# Altium schematic sheet 12.SchDoc
size 297 x 209 mm
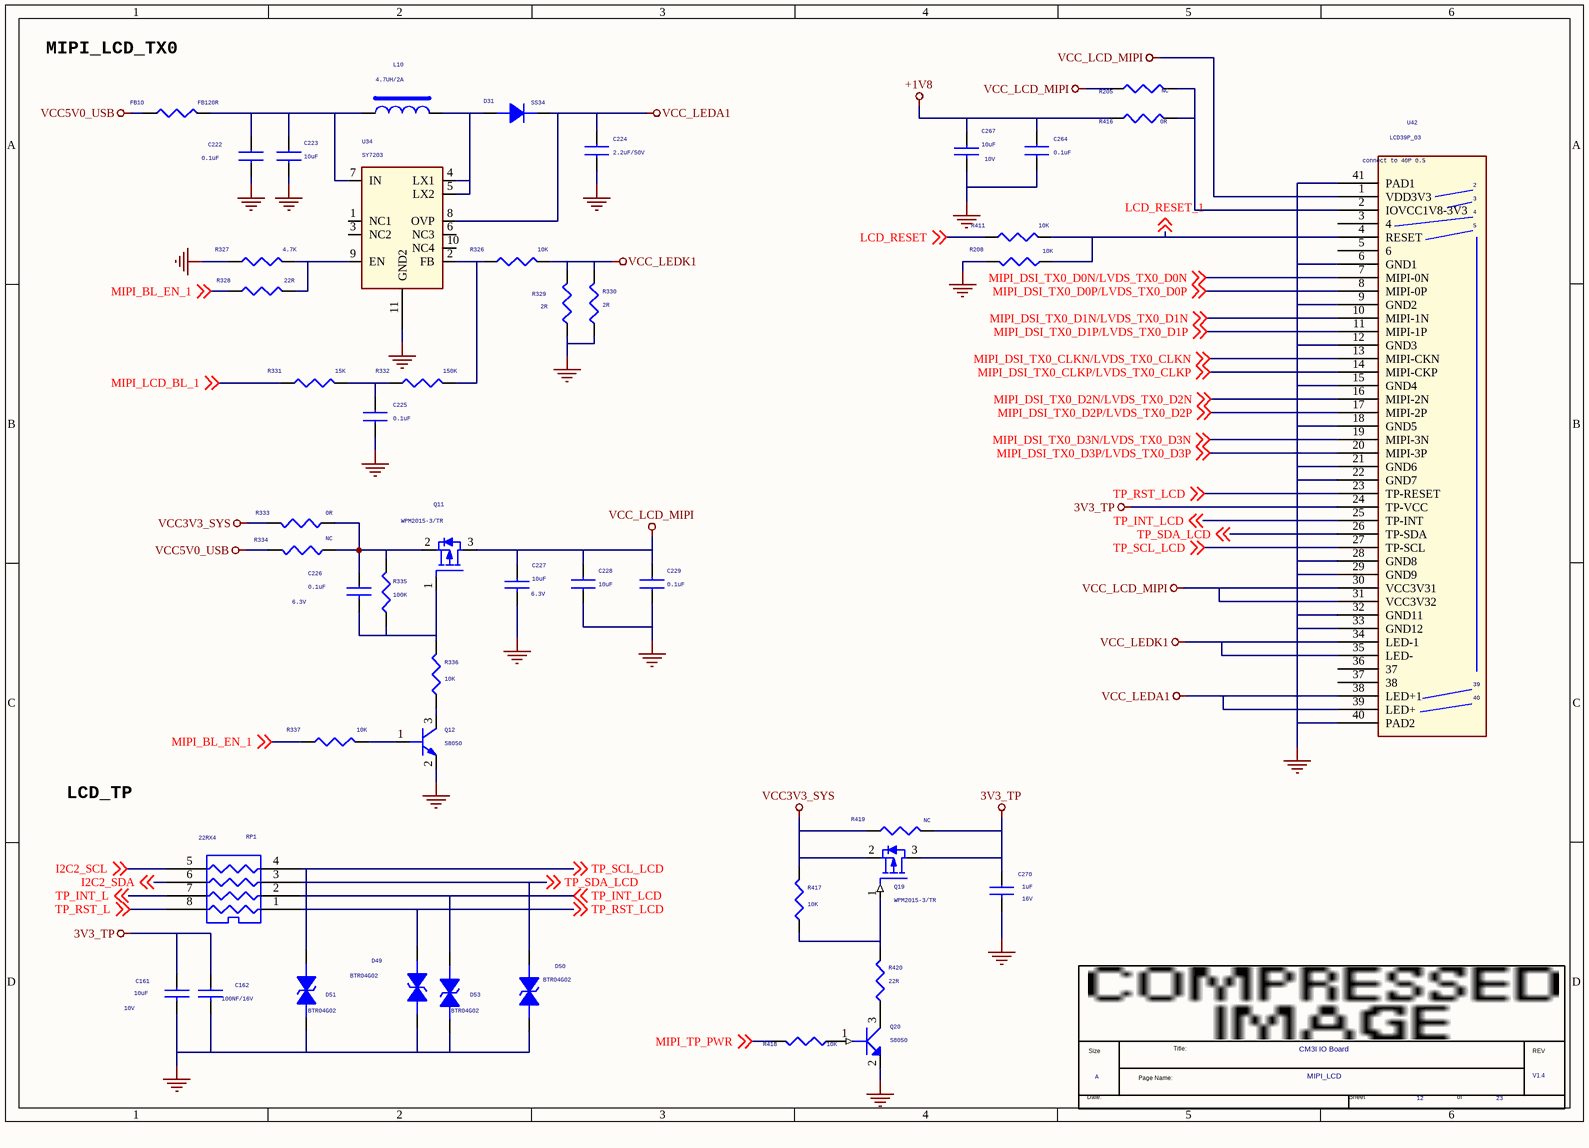
[diagram p0: 12.SchDoc]

## Parts
*  Page Count: 23  Page Number: 12  Page Size: A  Title: CM3I IO Board  RevCode: V1.4  Doc: MIPI_LCD  (hidden comment: radxa_1010)  (graphical)
C161  10uF  Voltage: 10V  [C0603]
C162  100NF/16V  [C0201]
C222  0.1uF  [C0603]
C223  10uF  [C0603]
C224  2.2uF/50V  [C0603]
C225  0.1uF  [C0603]
C226  0.1uF  Voltage: 6.3V  [C0402]
C227  10uF  Voltage: 6.3V  [C0603]
C228  10uF  [C0603]
C229  0.1uF  [C0603]
C264  0.1uF  [C0603]
C267  10uF  Voltage: 10V  [C0603]
C270  1uF  Voltage: 16V  [C0402]
D31  SS34  [DO214AC]
D49  BTR04G02  [ESD0402_1xD5]
D50  BTR04G02  [ESD0402_1xD5]
D51  BTR04G02  [ESD0402_1xD5]
D53  BTR04G02  [ESD0402_1xD5]
FB10  FB120R  [R0603]
L10  4.7UH/2A  [IND-4X4]
Q11  WPM2015-3/TR  [SOT23]
Q12  S8050  [SOT23]
Q19  WPM2015-3/TR  [SOT23]
Q20  S8050  [SOT23]
R205  NC  [R0402]
R208  10K  [R0201]
R326  10K  [R0402]
R327  4.7K  [R0402]
R328  22R  [R0402]
R329  2R  [R0805]
R330  2R  [R0805]
R331  15K  [R0402]
R332  150K  [R0402]
R333  0R  [R0603]
R334  NC  [R0603]
R335  100K  [R0402]
R336  10K  [R0402]
R337  10K  [R0402]
R411  10K  [R0201]
R416  0R  [R0402]
R417  10K  [R0402]
R418  10K  [R0402]
R419  NC  [R0402]
R420  22R  [R0402]
RP1  22RX4  [RN8P4RC]
U34  SY7203  [QFN8-2X2]
U42  LCD39P_03  [LCD39PIN-ok]

## Nets
3V3_TP: C161.1 C162.1 C270.1 Q19.3(DRAIN) R419.2 U42.24(TP-VCC)
+1V8: C264.1 C267.1 R416.1
GND: C161.2 C162.2 C222.2 C223.2 C224.2 C225.1 C227.2 C228.2 C229.2 C264.2 C267.2 C270.2 D49.2 D50.2 D51.2 D53.2 Q12.2(EMITTER) Q20.2(E) R208.2 R327.1 R329.2 R330.2 U34.11(GND2) U42.6(GND1) U42.9(GND2) U42.12(GND3) U42.15(GND4) U42.18(GND5) U42.21(GND6) U42.22(GND7) U42.28(GND8) U42.29(GND9) U42.32(GND11) U42.33(GND12) U42.40(PAD2) U42.41(PAD1)
VCC3V3_SYS: Q19.2(SOURCE) R333.1 R417.2 R419.1
VCC5V0_USB: FB10.1 R334.1
VCC_LCD_MIPI: C227.1 C228.1 C229.1 Q11.3(DRAIN) R205.1 U42.1(VDD3V3) U42.30(VCC3V31) U42.31(VCC3V32)
VCC_LEDA1: C224.1 D31.2(K) U34.8(OVP) U42.38(LED+1) U42.39(LED+)
VCC_LEDK1: R326.2 R329.1 R330.1 U42.34(LED-1) U42.35(LED-)
I2C2_SCL: RP1.5(R4) ; off-sheet I2C2_SCL
I2C2_SDA: RP1.6(R3) ; off-sheet I2C2_SDA
LCD_RESET: R411.1 ; off-sheet LCD_RESET
LCD_RESET_1: R208.1 R411.2 U42.4(RESET) ; off-sheet LCD_RESET_1
MIPI_BL_EN_1: R328.1 R337.1 ; off-sheet MIPI_BL_EN_1
MIPI_DSI_TX0_CLKN/LVDS_TX0_CLKN: U42.13(MIPI-CKN) ; off-sheet MIPI_DSI_TX0_CLKN/LVDS_TX0_CLKN
MIPI_DSI_TX0_CLKP/LVDS_TX0_CLKP: U42.14(MIPI-CKP) ; off-sheet MIPI_DSI_TX0_CLKP/LVDS_TX0_CLKP
MIPI_DSI_TX0_D0N/LVDS_TX0_D0N: U42.7(MIPI-0N) ; off-sheet MIPI_DSI_TX0_D0N/LVDS_TX0_D0N
MIPI_DSI_TX0_D0P/LVDS_TX0_D0P: U42.8(MIPI-0P) ; off-sheet MIPI_DSI_TX0_D0P/LVDS_TX0_D0P
MIPI_DSI_TX0_D1N/LVDS_TX0_D1N: U42.10(MIPI-1N) ; off-sheet MIPI_DSI_TX0_D1N/LVDS_TX0_D1N
MIPI_DSI_TX0_D1P/LVDS_TX0_D1P: U42.11(MIPI-1P) ; off-sheet MIPI_DSI_TX0_D1P/LVDS_TX0_D1P
MIPI_DSI_TX0_D2N/LVDS_TX0_D2N: U42.16(MIPI-2N) ; off-sheet MIPI_DSI_TX0_D2N/LVDS_TX0_D2N
MIPI_DSI_TX0_D2P/LVDS_TX0_D2P: U42.17(MIPI-2P) ; off-sheet MIPI_DSI_TX0_D2P/LVDS_TX0_D2P
MIPI_DSI_TX0_D3N/LVDS_TX0_D3N: U42.19(MIPI-3N) ; off-sheet MIPI_DSI_TX0_D3N/LVDS_TX0_D3N
MIPI_DSI_TX0_D3P/LVDS_TX0_D3P: U42.20(MIPI-3P) ; off-sheet MIPI_DSI_TX0_D3P/LVDS_TX0_D3P
MIPI_LCD_BL_1: R331.1 ; off-sheet MIPI_LCD_BL_1
MIPI_TP_PWR: R418.2 ; off-sheet MIPI_TP_PWR
TP_INT_L: RP1.7(R2) ; off-sheet TP_INT_L
TP_INT_LCD: D53.1 RP1.2(R2) U42.25(TP-INT) ; off-sheet TP_INT_LCD
TP_RST_L: RP1.8(R1) ; off-sheet TP_RST_L
TP_RST_LCD: D49.1 RP1.1(R1) U42.23(TP-RESET) ; off-sheet TP_RST_LCD
TP_SCL_LCD: D51.1 RP1.4(R4) U42.27(TP-SCL) ; off-sheet TP_SCL_LCD
TP_SDA_LCD: D50.1 RP1.3(R3) U42.26(TP-SDA) ; off-sheet TP_SDA_LCD
NetC222_1: C222.1 C223.1 FB10.2 L10.1 U34.7(IN)
NetC225_2: C225.2 R331.2 R332.1
NetC226_1: C226.1 Q11.2(SOURCE) R333.2 R334.2 R335.1
NetC226_2: C226.2 Q11.1(GATE) R335.2 R336.1
NetD31_1: D31.1(A) L10.2 U34.4(LX1) U34.5(LX2)
NetQ12_1: Q12.1(BASE) R337.2
NetQ12_3: Q12.3(COLLECTOR) R336.2
NetQ19_1: Q19.1(GATE) R417.1 R420.2
NetQ20_1: Q20.1(B) R418.1
NetQ20_3: Q20.3(C) R420.1
NetR205_2: R205.2 R416.2 U42.2(IOVCC1V8-3V3)
NetR326_1: R326.1 R332.2 U34.2(FB)
NetR327_2: R327.2 R328.2 U34.9(EN)

Not connected (* = marked no-connect by the designer): U34 1(NC1) 3(NC2) 6(NC3) 10(NC4); U42 3(4) 5(6) 36(37) 37(38)

## Notes on the sheet
- MIPI_LCD_TX0
- LCD_TP
- (in symbol LCD39P_03) connect to 40P 0.5
- (in symbol radxa_1010) Size; Title:; REV; Page Name:; Date:; Sheet; of

## Library data of the parts
C161 = CAP NP_0_Dup3: cap,10.00uF,+/-10%,10V,X5R,C0603; Manufacturer PN: C1608X5R1A106K080AC; Manufacturer: TDK; Tolerance: 10%; Priority: A; Dielectric: X5R; Created by: JJJ; Part Type: C0603; RK PN: C1608X5R1A106K080AC
C162 = CAP NP_0_Dup3: cap,100.00nF,+/-10%,16V,X5R,C0402; Manufacturer: TDK; RK PN: C1005X5R1C104K050BA; Priority: A; Tolerance: 10%; Voltage: 16V; Dielectric: X5R; Part Type: C0402; Manufacturer PN: C1005X5R1C104K050BA; Created by: JJJ
C222 C229 C264 = CAP NP_Dup2: CAP,MLCC,100nF,+/-10%,X7R,6.3V,SMD0402
C223 = CAP NP_Dup2
C224 = CAP NP_Dup2: RoHS CHIP CAP 1uF +10/-10% 25V X5R
C225 = CAP NP_Dup2: RoHS CHIP CAP 0.1uF +10/-10% X7R
C226 = CAP NP_0: cap,100.00nF,+/-10%,6.3V,X5R,C0402; Manufacturer: TDK; RK PN: C1005X5R0J104K050BA; Priority: A; Tolerance: 10%; Dielectric: X5R; Part Type: C0402; Manufacturer PN: C1005X5R0J104K050BA; Created by: JJJ
C227 = CAP NP_0: cap,4.70uF,+/-10%,6.3V,X5R,C0603; Manufacturer PN: C1608X5R0J475K080AB; Manufacturer: TDK; Tolerance: 10%; Priority: A; Dielectric: X5R; Created by: JJJ; Part Type: C0603; RK PN: C1608X5R0J475K080AB
C228 = CAP NP_Dup2: CAP,MLCC,4.7uF,+/-10%,X5R,6.3V,SMD0603
C267 = CAP NP_0_Dup3: cap,10.00uF,+/-10%,10V,X5R,C0805; Manufacturer PN: C2012X5R1A106K125AB; Manufacturer: TDK; Tolerance: 10%; Priority: A; Dielectric: X5R; Created by: JJJ; Part Type: C0805; RK PN: C2012X5R1A106K125AB
C270 = CAP NP_0: cap,100.00nF,+/-10%,6.3V,X5R,C0402; Manufacturer PN: C1005X5R0J104K050BA; Manufacturer: TDK; Tolerance: 10%; Priority: A; Dielectric: X5R; Created by: JJJ; Part Type: C0402; RK PN: C1005X5R0J104K050BA
D31 = DIODE
D49 D53 = DIODE BI_DIR TRIG_0: 1-Line, Bi-directional, Transient Voltage Suppressors.17.5pF.; Manufacturer: WillSemi(韦尔半导体); RK PN: ESD5451N; Priority: A; OPTION: DNP; Part Type: ESD_TVS; Manufacturer PN: ESD5451N; Created by: JJJ
D50 D51 = DIODE BI_DIR TRIG_0: 1-Line, Bi-directional, Transient Voltage Suppressors.17.5pF.; Manufacturer PN: ESD5451N; Manufacturer: WillSemi(韦尔半导体); OPTION: DNP; Priority: A; Created by: JJJ; Part Type: ESD_TVS; RK PN: ESD5451N
FB10 R208 R327 R331 R332 R411 = RES 1B: ROHS CHIP RES 4.7K 1/16W 5%
L10 = INDUCTORS OF FERRITE
Q11 = MOSFET P_Dup1: PMOS,WPM2015-3/TR,SOT23,Id=2.4A,Vds=20V; Manufacturer: WillSemi(韦尔半导体); Priority: A; Id: 2.4A; Vgs: ±8V; VDS: 20V; Vgsth: 0.62V; Pd: 0.5W; RK PN: WPM2015-3/TR; Part Type: PMOS; Manufacturer PN: WPM2015-3/TR; Created by: JJJ
Q12 = NPN: S8050 SOT23; Manufacturer: 长电; Manufacturer PN: S8050_SOT23; Priority: A; Ic: 0.5A; Vceo: 25V; Pc: 0.3W; RK PN: S8050; Part Type: NPN; Created by: JJJ
Q19 = MOSFET P: PMOS,WPM2015-3/TR,SOT_23,Id=2.4A,Vds=20V; Manufacturer: WillSemi(韦尔半导体); option: DNP; Pd: 0.5W; Vgsth: 0.62V; VDS: 20V; Vgs: ±8V; Id_max: 2.4A; Priority: A; ROOM: CHG; Created by: JJJ; Manufacturer PN: WPM2015-3/TR; Part Type: PMOS; RK PN: WPM2015-3/TR
Q20 = NPN4
R205 = RESISTOR_0_Dup4: 通用厚膜电阻,100K,+/-5%,R0402,1/16W.; Manufacturer PN: RC0402JR-07100KL; Manufacturer: YAGEO; Tolerance: 5%; Wattage: 1/16W; Priority: A; Created by: YTL; Part Type: 通用厚膜电阻; RK PN: RC0402JR-07100KL
R326 = RES 1B: ROHS CHIP RES 82K 1/16W 5%
R328 R337 R417 = RESISTOR_0_Dup1: 通用厚膜电阻,10K,+/-5%,R0402,1/16W.; Manufacturer: YAGEO; Tolerance: 5%; RK PN: RC0402JR-0710KL; Priority: A; Wattage: 1/16W; Part Type: 通用厚膜电阻; Manufacturer PN: RC0402JR-0710KL; Created by: YTL
R329 R330 R333 R334 = RES 1B: ROHS CHIP RES 4.7R 1/4W 5%
R335 R418 = RESISTOR_0_Dup1: 通用厚膜电阻,100K,+/-5%,R0402,1/16W.; Manufacturer: YAGEO; Tolerance: 5%; RK PN: RC0402JR-07100KL; Priority: A; Wattage: 1/16W; Part Type: 通用厚膜电阻; Manufacturer PN: RC0402JR-07100KL; Created by: YTL
R336 = RESISTOR_0_Dup1: 通用厚膜电阻,10K,+/-5%,R0402,1/16W.; Manufacturer PN: RC0402JR-0710KL; Manufacturer: YAGEO; Tolerance: 5%; Wattage: 1/16W; Priority: A; Created by: YTL; Part Type: 通用厚膜电阻; RK PN: RC0402JR-0710KL
R416 = RESISTOR_0_Dup4: 通用厚膜电阻,100K,+/-5%,R0402,1/16W.; Manufacturer: YAGEO; Tolerance: 5%; RK PN: RC0402JR-07100KL; Priority: A; Wattage: 1/16W; Part Type: 通用厚膜电阻; Manufacturer PN: RC0402JR-07100KL; Created by: YTL
R419 = RESISTOR_0_Dup1: 通用厚膜电阻,0R,+/-5%,R0402,1/16W.; Manufacturer PN: RC0402JR-070RL; Manufacturer: YAGEO; Tolerance: 5%; Wattage: 1/16W; Priority: A; Created by: YTL; Part Type: 通用厚膜电阻; RK PN: RC0402JR-070RL
R420 = RESISTOR_0_Dup6
RP1 = R-PACK4
U34 = MP3202-QFN8_1
* = radxa_1010: Page Create Date: March  8, 1995